# EAGLE schematic Sensormain_of_Tatebayashi (EAGLE 9.6.2)

## Sheet 1 of 5
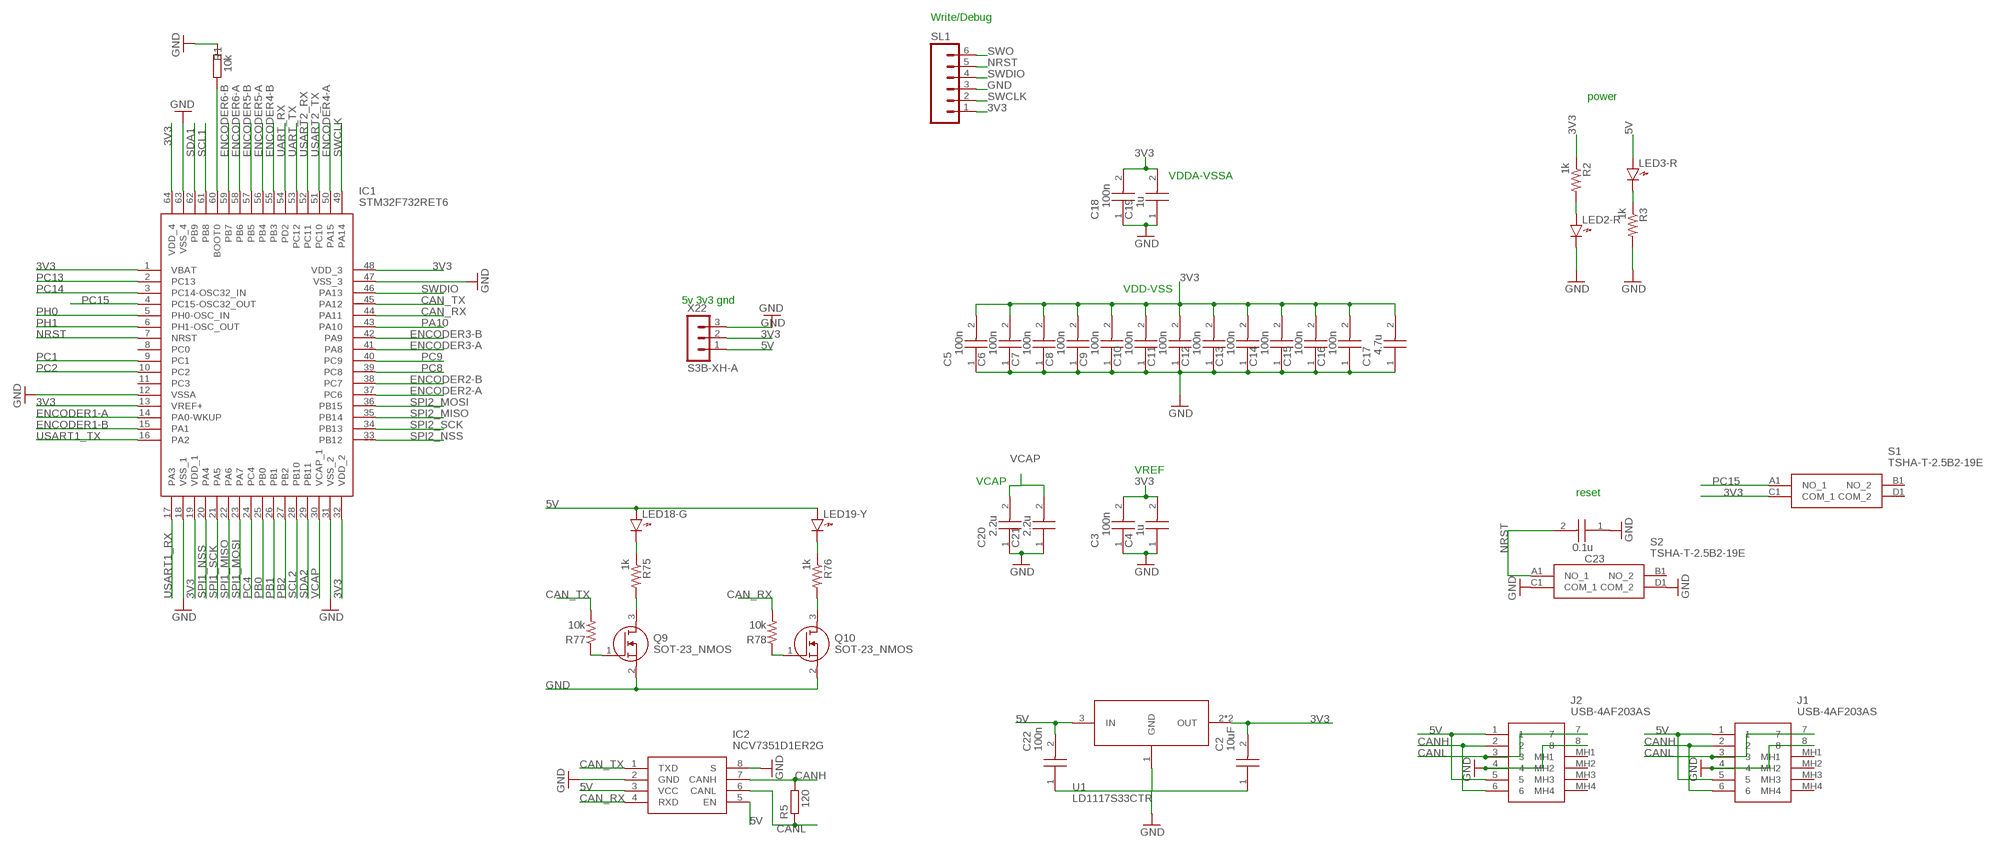
[diagram p0: schematic, sheet 1]

### Parts
C2  10uF  GRM188B31A106KE69D  [CAPC1608X90N]
C3  100n  AMK107BBJ476MA-RE  [CAPC1709X100N]
C4  1u  AMK107BBJ476MA-RE  [CAPC1709X100N]
C5  100n  AMK107BBJ476MA-RE  [CAPC1709X100N]
C6  100n  AMK107BBJ476MA-RE  [CAPC1709X100N]
C7  100n  AMK107BBJ476MA-RE  [CAPC1709X100N]
C8  100n  AMK107BBJ476MA-RE  [CAPC1709X100N]
C9  100n  AMK107BBJ476MA-RE  [CAPC1709X100N]
C10  100n  AMK107BBJ476MA-RE  [CAPC1709X100N]
C11  100n  AMK107BBJ476MA-RE  [CAPC1709X100N]
C12  100n  AMK107BBJ476MA-RE  [CAPC1709X100N]
C13  100n  AMK107BBJ476MA-RE  [CAPC1709X100N]
C14  100n  AMK107BBJ476MA-RE  [CAPC1709X100N]
C15  100n  AMK107BBJ476MA-RE  [CAPC1709X100N]
C16  100n  AMK107BBJ476MA-RE  [CAPC1709X100N]
C17  4.7u  AMK107BBJ476MA-RE  [CAPC1709X100N]
C18  100n  AMK107BBJ476MA-RE  [CAPC1709X100N]
C19  1u  AMK107BBJ476MA-RE  [CAPC1709X100N]
C20  2.2u  AMK107BBJ476MA-RE  [CAPC1709X100N]
C21  2.2u  AMK107BBJ476MA-RE  [CAPC1709X100N]
C22  100n  GRM188B31A106KE69D  [CAPC1608X90N]
C23  0.1u  AMK107BBJ476MA-RE  [CAPC1709X100N]
IC1  STM32F732RET6  [QFP50P1200X1200X160-64N]
IC2  NCV7351D1ER2G  [SOIC127P600X175-8N]
J1  USB-4AF203AS  [USB4AF203AS]
J2  USB-4AF203AS  [USB4AF203AS]
LED2-R  LED1608  [LED1608]
LED3-R  LED1608  [LED1608]
LED18-G  LED1608  [LED1608]
LED19-Y  LED1608  [LED1608]
Q9  SOT-23_NMOS  [SOT-23]
Q10  SOT-23_NMOS  [SOT-23]
R1  10k  R1608  [1608]
R2  1k  R-US_R0603  [R0603]
R3  1k  R-US_R0603  [R0603]
R5  120  R-EU_R0805  [R0805]
R75  1k  R-US_R0603  [R0603]
R76  1k  R-US_R0603  [R0603]
R77  10k  RESISTOR-US1608  [SMD1608]
R78  10k  RESISTOR-US1608  [SMD1608]
S1  TSHA-T-2.5B2-19E  [TSHAT25B219E]
S2  TSHA-T-2.5B2-19E  [TSHAT25B219E]
SL1  MA06  [06PA]
U1  LD1117S33CTR  [SOT223]
X22  S3B-XH-A  [S3B-XH-A]

### Nets
3V3: C2.2 C3.2 C4.2 C5.2 C6.2 C7.2 C8.2 C9.2 C10.2 C11.2 C12.2 C13.2 C14.2 C15.2 C16.2 C17.2 C18.2 C19.2 IC1.1(VBAT) IC1.13(VREF+) IC1.19(VDD_1) IC1.32(VDD_2) IC1.48(VDD_3) IC1.64(VDD_4) R2.1 S1.C1(COM_1) SL1.1 U1.2(OUT) U1.4(OUT) X22.2 ; also sheet 3,4,5
5V: C22.2 IC2.3(VCC) IC2.5(EN) J1.1 J1.5 J2.1 J2.5 LED3-R.A LED18-G.A LED19-Y.A U1.3(IN) X22.1 ; also sheet 2,3,4,5
CAN_RX: IC1.44(PA11) IC2.4(RXD) R78.2
CAN_TX: IC1.45(PA12) IC2.1(TXD) R77.2
CANH: IC2.7(CANH) J1.2 J1.6 J2.2 J2.6 R5.2
CANL: IC2.6(CANL) J1.3 J1.7 J2.3 J2.7 R5.1
ENCODER1-A: IC1.14(PA0-WKUP) ; also sheet 2
ENCODER1-B: IC1.15(PA1) ; also sheet 2
ENCODER2-A: IC1.37(PC6) ; also sheet 2
ENCODER2-B: IC1.38(PC7) ; also sheet 2
ENCODER3-A: IC1.41(PA8) ; also sheet 2
ENCODER3-B: IC1.42(PA9) ; also sheet 2
ENCODER4-A: IC1.50(PA15) ; also sheet 2
ENCODER4-B: IC1.55(PB3) ; also sheet 2
ENCODER5-A: IC1.56(PB4) ; also sheet 2
ENCODER5-B: IC1.57(PB5) ; also sheet 2
ENCODER6-A: IC1.58(PB6) ; also sheet 2
ENCODER6-B: IC1.59(PB7) ; also sheet 2
GND: C2.1 C3.1 C4.1 C5.1 C6.1 C7.1 C8.1 C9.1 C10.1 C11.1 C12.1 C13.1 C14.1 C15.1 C16.1 C17.1 C18.1 C19.1 C20.1 C21.1 C22.1 C23.1 IC1.12(VSSA) IC1.18(VSS_1) IC1.31(VSS_2) IC1.47(VSS_3) IC1.63(VSS_4) IC2.2(GND) IC2.8(S) J1.4 J1.8 J2.4 J2.8 LED2-R.K Q9.2(S) Q10.2(S) R1.2 R3.2 S2.C1(COM_1) S2.D1(COM_2) SL1.3 U1.1(GND) X22.3 ; also sheet 2,3,4,5
N$7: LED2-R.A R2.2
N$8: LED3-R.K R3.1
N$15: IC1.60(BOOT0) R1.1
N$71: Q9.1(G) R77.1
N$72: Q10.1(G) R78.1
N$73: LED18-G.K R75.1
N$75: LED19-Y.K R76.1
N$80: Q9.3(D) R75.2
N$85: Q10.3(D) R76.2
NRST: C23.2 IC1.7(NRST) S2.A1(NO_1) SL1.5
PA10: IC1.43(PA10) ; also sheet 4
PB0: IC1.25(PB0) ; also sheet 5
PB1: IC1.26(PB1) ; also sheet 5
PB2: IC1.27(PB2) ; also sheet 4
PC1: IC1.9(PC1) ; also sheet 5
PC2: IC1.10(PC2) ; also sheet 5
PC4: IC1.24(PC4) ; also sheet 5
PC8: IC1.39(PC8) ; also sheet 4
PC9: IC1.40(PC9) ; also sheet 4
PC13: IC1.2(PC13) ; also sheet 5
PC14: IC1.3(PC14-OSC32_IN) ; also sheet 5
PC15: IC1.4(PC15-OSC32_OUT) S1.A1(NO_1)
PH0: IC1.5(PH0-OSC_IN) ; also sheet 5
PH1: IC1.6(PH1-OSC_OUT) ; also sheet 5
SCL1: IC1.61(PB8) ; also sheet 4
SCL2: IC1.28(PB10) ; also sheet 4
SDA1: IC1.62(PB9) ; also sheet 4
SDA2: IC1.29(PB11) ; also sheet 4
SPI1_MISO: IC1.22(PA6) ; also sheet 3
SPI1_MOSI: IC1.23(PA7) ; also sheet 3
SPI1_NSS: IC1.20(PA4) ; also sheet 3
SPI1_SCK: IC1.21(PA5) ; also sheet 3
SPI2_MISO: IC1.35(PB14) ; also sheet 4
SPI2_MOSI: IC1.36(PB15) ; also sheet 4
SPI2_NSS: IC1.33(PB12) ; also sheet 4
SPI2_SCK: IC1.34(PB13) ; also sheet 4
SWCLK: IC1.49(PA14) SL1.2
SWDIO: IC1.46(PA13) SL1.4
SWO: SL1.6
UART_RX: IC1.54(PD2) ; also sheet 4
UART_TX: IC1.53(PC12) ; also sheet 4
USART1_RX: IC1.17(PA3) ; also sheet 4
USART1_TX: IC1.16(PA2) ; also sheet 4
USART2_RX: IC1.52(PC11) ; also sheet 4
USART2_TX: IC1.51(PC10) ; also sheet 4
VCAP: C20.2 C21.2 IC1.30(VCAP_1)
Unconnected: IC1.8(PC0) IC1.11(PC3) J1.MH1 J1.MH2 J1.MH3 J1.MH4 J2.MH1 J2.MH2 J2.MH3 J2.MH4 S1.B1(NO_2) S1.D1(COM_2) S2.B1(NO_2)

### Notes on the sheet
- Write/Debug
- power
- VDDA-VSSA
- VDD-VSS
- 5v 3v3 gnd
- VREF
- VCAP
- reset

## Sheet 2 of 5
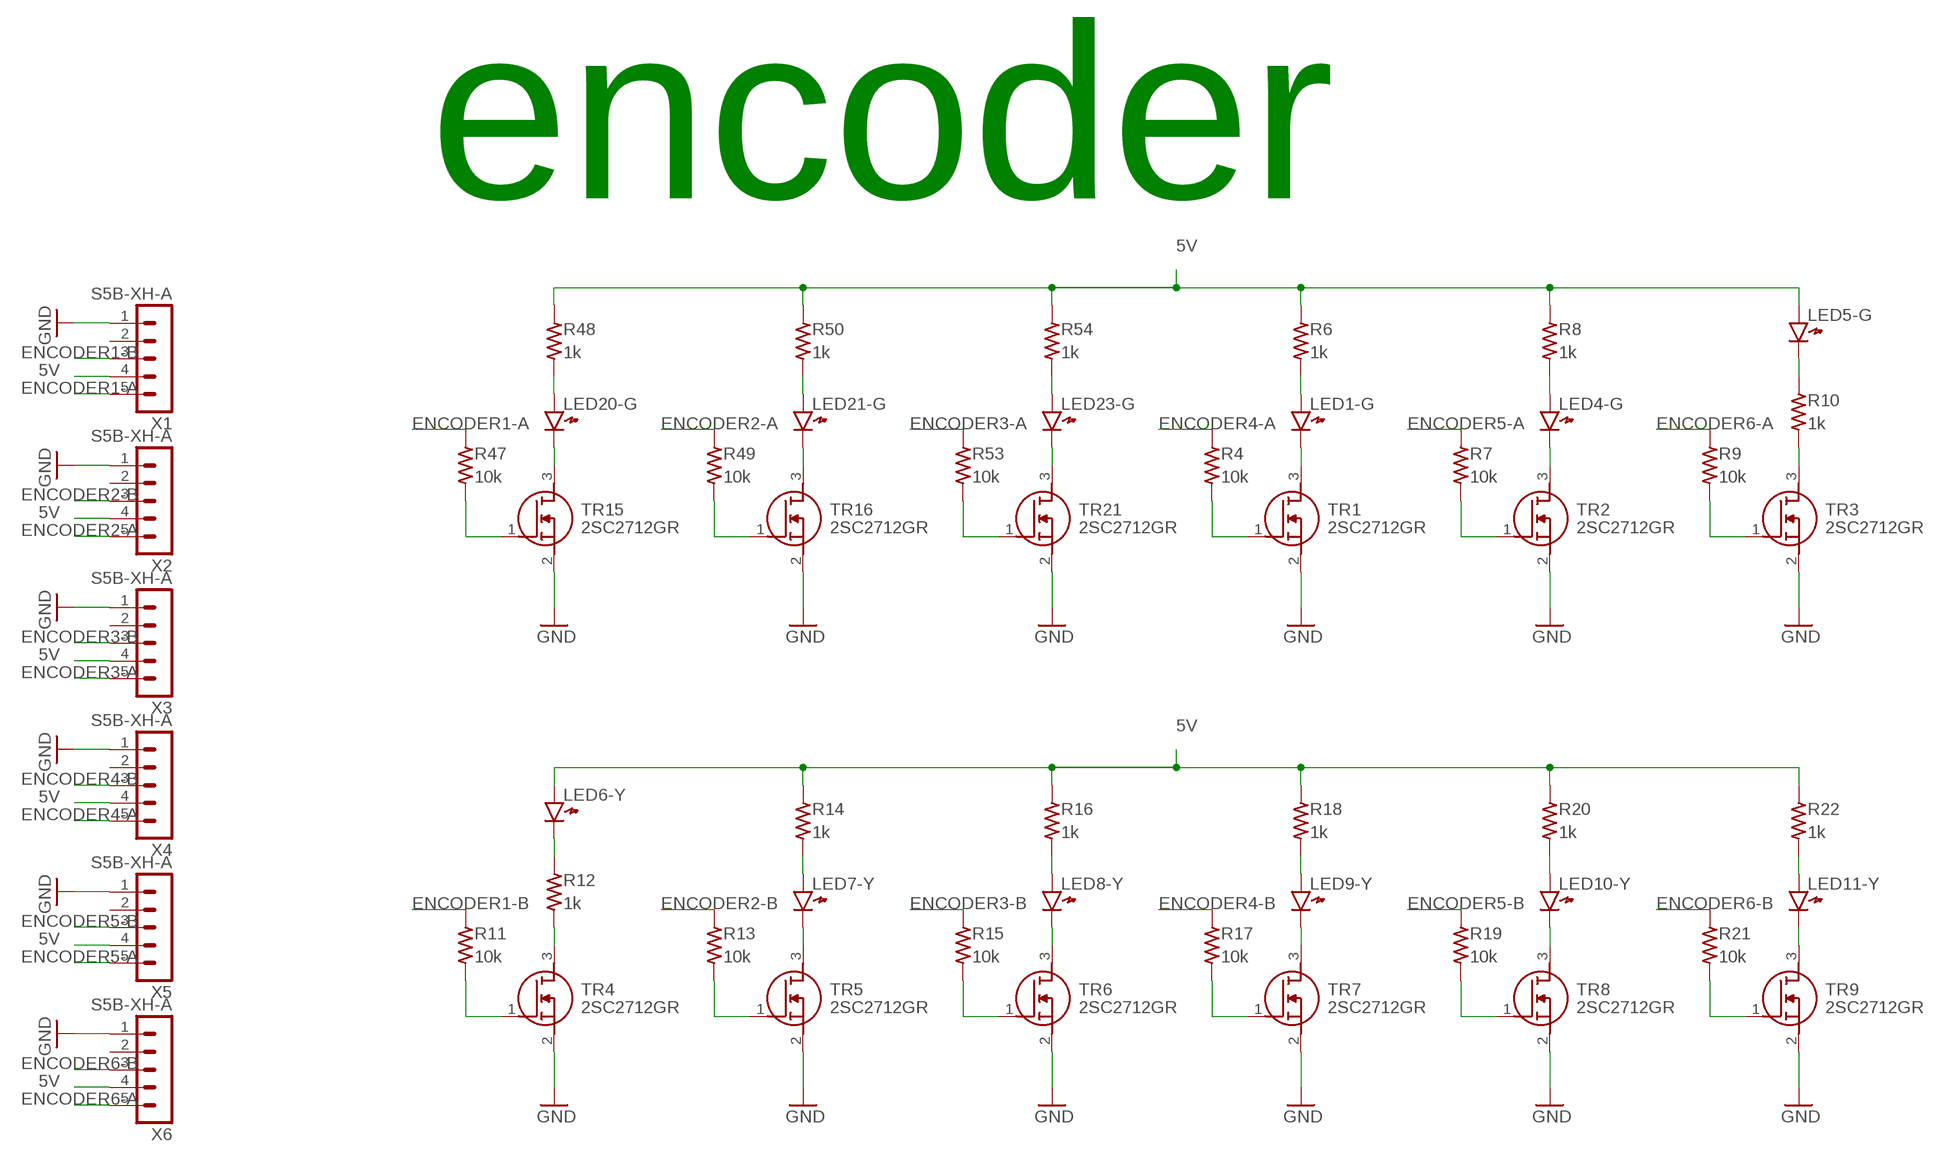
[diagram p1: schematic, sheet 2]

### Parts
LED1-G  LED1608  [LED1608]
LED4-G  LED1608  [LED1608]
LED5-G  LED1608  [LED1608]
LED6-Y  LED1608  [LED1608]
LED7-Y  LED1608  [LED1608]
LED8-Y  LED1608  [LED1608]
LED9-Y  LED1608  [LED1608]
LED10-Y  LED1608  [LED1608]
LED11-Y  LED1608  [LED1608]
LED20-G  LED1608  [LED1608]
LED21-G  LED1608  [LED1608]
LED23-G  LED1608  [LED1608]
R4  10k  RESISTOR-US1608  [SMD1608]
R6  1k  RESISTOR-US1608  [SMD1608]
R7  10k  RESISTOR-US1608  [SMD1608]
R8  1k  RESISTOR-US1608  [SMD1608]
R9  10k  RESISTOR-US1608  [SMD1608]
R10  1k  RESISTOR-US1608  [SMD1608]
R11  10k  RESISTOR-US1608  [SMD1608]
R12  1k  RESISTOR-US1608  [SMD1608]
R13  10k  RESISTOR-US1608  [SMD1608]
R14  1k  RESISTOR-US1608  [SMD1608]
R15  10k  RESISTOR-US1608  [SMD1608]
R16  1k  RESISTOR-US1608  [SMD1608]
R17  10k  RESISTOR-US1608  [SMD1608]
R18  1k  RESISTOR-US1608  [SMD1608]
R19  10k  RESISTOR-US1608  [SMD1608]
R20  1k  RESISTOR-US1608  [SMD1608]
R21  10k  RESISTOR-US1608  [SMD1608]
R22  1k  RESISTOR-US1608  [SMD1608]
R47  10k  RESISTOR-US1608  [SMD1608]
R48  1k  RESISTOR-US1608  [SMD1608]
R49  10k  RESISTOR-US1608  [SMD1608]
R50  1k  RESISTOR-US1608  [SMD1608]
R53  10k  RESISTOR-US1608  [SMD1608]
R54  1k  RESISTOR-US1608  [SMD1608]
TR1  2SC2712GR  SOT-23_NMOS  [SOT-23]
TR2  2SC2712GR  SOT-23_NMOS  [SOT-23]
TR3  2SC2712GR  SOT-23_NMOS  [SOT-23]
TR4  2SC2712GR  SOT-23_NMOS  [SOT-23]
TR5  2SC2712GR  SOT-23_NMOS  [SOT-23]
TR6  2SC2712GR  SOT-23_NMOS  [SOT-23]
TR7  2SC2712GR  SOT-23_NMOS  [SOT-23]
TR8  2SC2712GR  SOT-23_NMOS  [SOT-23]
TR9  2SC2712GR  SOT-23_NMOS  [SOT-23]
TR15  2SC2712GR  SOT-23_NMOS  [SOT-23]
TR16  2SC2712GR  SOT-23_NMOS  [SOT-23]
TR21  2SC2712GR  SOT-23_NMOS  [SOT-23]
X1  S5B-XH-A  [S5B-XH-A]
X2  S5B-XH-A  [S5B-XH-A]
X3  S5B-XH-A  [S5B-XH-A]
X4  S5B-XH-A  [S5B-XH-A]
X5  S5B-XH-A  [S5B-XH-A]
X6  S5B-XH-A  [S5B-XH-A]

### Nets
5V: LED5-G.A LED6-Y.A R6.1 R8.1 R14.1 R16.1 R18.1 R20.1 R22.1 R48.1 R50.1 R54.1 X1.4 X2.4 X3.4 X4.4 X5.4 X6.4 ; also sheet 1,3,4,5
ENCODER1-A: R47.1 X1.5 ; also sheet 1
ENCODER1-B: R11.1 X1.3 ; also sheet 1
ENCODER2-A: R49.1 X2.5 ; also sheet 1
ENCODER2-B: R13.1 X2.3 ; also sheet 1
ENCODER3-A: R53.1 X3.5 ; also sheet 1
ENCODER3-B: R15.1 X3.3 ; also sheet 1
ENCODER4-A: R4.1 X4.5 ; also sheet 1
ENCODER4-B: R17.1 X4.3 ; also sheet 1
ENCODER5-A: R7.1 X5.5 ; also sheet 1
ENCODER5-B: R19.1 X5.3 ; also sheet 1
ENCODER6-A: R9.1 X6.5 ; also sheet 1
ENCODER6-B: R21.1 X6.3 ; also sheet 1
GND: TR1.2(S) TR2.2(S) TR3.2(S) TR4.2(S) TR5.2(S) TR6.2(S) TR7.2(S) TR8.2(S) TR9.2(S) TR15.2(S) TR16.2(S) TR21.2(S) X1.1 X2.1 X3.1 X4.1 X5.1 X6.1 ; also sheet 1,3,4,5
N$1: LED20-G.K TR15.3(D)
N$2: LED20-G.A R48.2
N$3: R49.2 TR16.1(G)
N$4: R47.2 TR15.1(G)
N$5: LED21-G.K TR16.3(D)
N$6: LED21-G.A R50.2
N$9: R4.2 TR1.1(G)
N$10: R53.2 TR21.1(G)
N$11: LED1-G.K TR1.3(D)
N$12: LED1-G.A R6.2
N$13: LED23-G.K TR21.3(D)
N$14: R7.2 TR2.1(G)
N$16: LED4-G.K TR2.3(D)
N$17: LED4-G.A R8.2
N$18: R9.2 TR3.1(G)
N$19: LED5-G.K R10.1
N$20: R10.2 TR3.3(D)
N$21: R11.2 TR4.1(G)
N$22: LED6-Y.K R12.1
N$23: R12.2 TR4.3(D)
N$24: LED23-G.A R54.2
N$25: R13.2 TR5.1(G)
N$26: LED7-Y.K TR5.3(D)
N$27: LED7-Y.A R14.2
N$28: R15.2 TR6.1(G)
N$29: LED8-Y.K TR6.3(D)
N$30: LED8-Y.A R16.2
N$31: R17.2 TR7.1(G)
N$32: LED9-Y.K TR7.3(D)
N$33: LED9-Y.A R18.2
N$34: R19.2 TR8.1(G)
N$35: LED10-Y.K TR8.3(D)
N$36: LED10-Y.A R20.2
N$37: R21.2 TR9.1(G)
N$38: LED11-Y.A R22.2
N$39: LED11-Y.K TR9.3(D)
Unconnected: X1.2 X2.2 X3.2 X4.2 X5.2 X6.2

### Notes on the sheet
- encoder

## Sheet 3 of 5
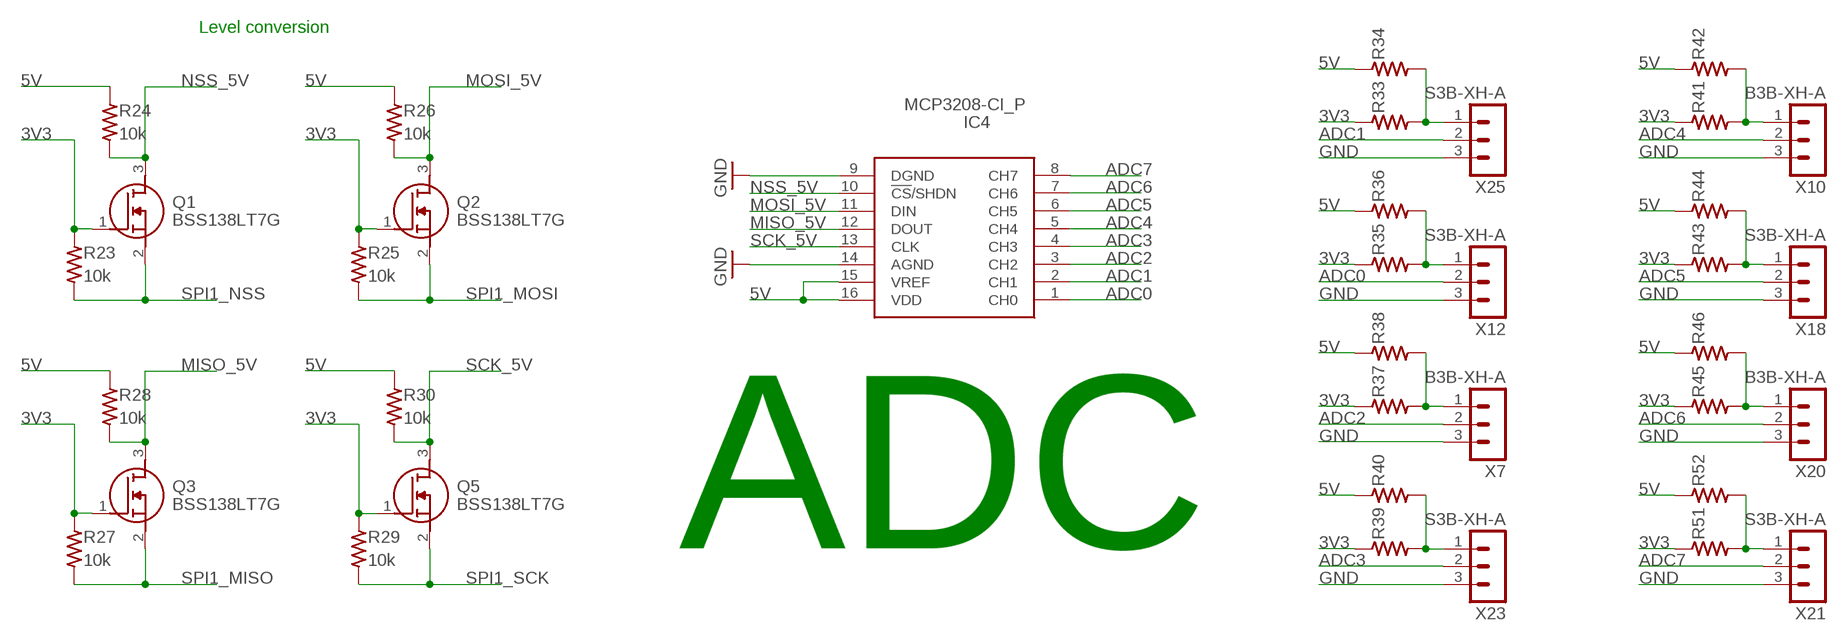
[diagram p2: schematic, sheet 3]

### Parts
IC4  MCP3208-CI_P  [DIP781W56P254L1918H533Q16N]
Q1  BSS138LT7G  [SOT96P237X111-3N]
Q2  BSS138LT7G  [SOT96P237X111-3N]
Q3  BSS138LT7G  [SOT96P237X111-3N]
Q5  BSS138LT7G  [SOT96P237X111-3N]
R23  10k  RESISTOR-US1608  [SMD1608]
R24  10k  RESISTOR-US1608  [SMD1608]
R25  10k  RESISTOR-US1608  [SMD1608]
R26  10k  RESISTOR-US1608  [SMD1608]
R27  10k  RESISTOR-US1608  [SMD1608]
R28  10k  RESISTOR-US1608  [SMD1608]
R29  10k  RESISTOR-US1608  [SMD1608]
R30  10k  RESISTOR-US1608  [SMD1608]
R33  RESISTOR-US1608  [SMD1608]
R34  RESISTOR-US1608  [SMD1608]
R35  RESISTOR-US1608  [SMD1608]
R36  RESISTOR-US1608  [SMD1608]
R37  RESISTOR-US1608  [SMD1608]
R38  RESISTOR-US1608  [SMD1608]
R39  RESISTOR-US1608  [SMD1608]
R40  RESISTOR-US1608  [SMD1608]
R41  RESISTOR-US1608  [SMD1608]
R42  RESISTOR-US1608  [SMD1608]
R43  RESISTOR-US1608  [SMD1608]
R44  RESISTOR-US1608  [SMD1608]
R45  RESISTOR-US1608  [SMD1608]
R46  RESISTOR-US1608  [SMD1608]
R51  RESISTOR-US1608  [SMD1608]
R52  RESISTOR-US1608  [SMD1608]
X7  B3B-XH-A  [B3B-XH-A]
X10  B3B-XH-A  [B3B-XH-A]
X12  S3B-XH-A  [S3B-XH-A]
X18  S3B-XH-A  [S3B-XH-A]
X20  B3B-XH-A  [B3B-XH-A]
X21  S3B-XH-A  [S3B-XH-A]
X23  S3B-XH-A  [S3B-XH-A]
X25  S3B-XH-A  [S3B-XH-A]

### Nets
3V3: Q1.1(G) Q2.1(G) Q3.1(G) Q5.1(G) R23.1 R25.1 R27.1 R29.1 R33.1 R35.1 R37.1 R39.1 R41.1 R43.1 R45.1 R51.1 ; also sheet 1,4,5
5V: IC4.15(VREF) IC4.16(VDD) R24.1 R26.1 R28.1 R30.1 R34.1 R36.1 R38.1 R40.1 R42.1 R44.1 R46.1 R52.1 ; also sheet 1,2,4,5
ADC0: IC4.1(CH0) X12.2
ADC1: IC4.2(CH1) X25.2
ADC2: IC4.3(CH2) X7.2
ADC3: IC4.4(CH3) X23.2
ADC4: IC4.5(CH4) X10.2
ADC5: IC4.6(CH5) X18.2
ADC6: IC4.7(CH6) X20.2
ADC7: IC4.8(CH7) X21.2
GND: IC4.9(DGND) IC4.14(AGND) X7.3 X10.3 X12.3 X18.3 X20.3 X21.3 X23.3 X25.3 ; also sheet 1,2,4,5
MISO_5V: IC4.12(DOUT) Q3.3(D) R28.2
MOSI_5V: IC4.11(DIN) Q2.3(D) R26.2
N$42: R33.2 R34.2 X25.1
N$43: R35.2 R36.2 X12.1
N$44: R37.2 R38.2 X7.1
N$45: R39.2 R40.2 X23.1
N$46: R41.2 R42.2 X10.1
N$47: R43.2 R44.2 X18.1
N$48: R45.2 R46.2 X20.1
N$49: R51.2 R52.2 X21.1
NSS_5V: IC4.10(!CS!/SHDN) Q1.3(D) R24.2
SCK_5V: IC4.13(CLK) Q5.3(D) R30.2
SPI1_MISO: Q3.2(S) R27.2 ; also sheet 1
SPI1_MOSI: Q2.2(S) R25.2 ; also sheet 1
SPI1_NSS: Q1.2(S) R23.2 ; also sheet 1
SPI1_SCK: Q5.2(S) R29.2 ; also sheet 1

### Notes on the sheet
- Level conversion
- ADC

## Sheet 4 of 5
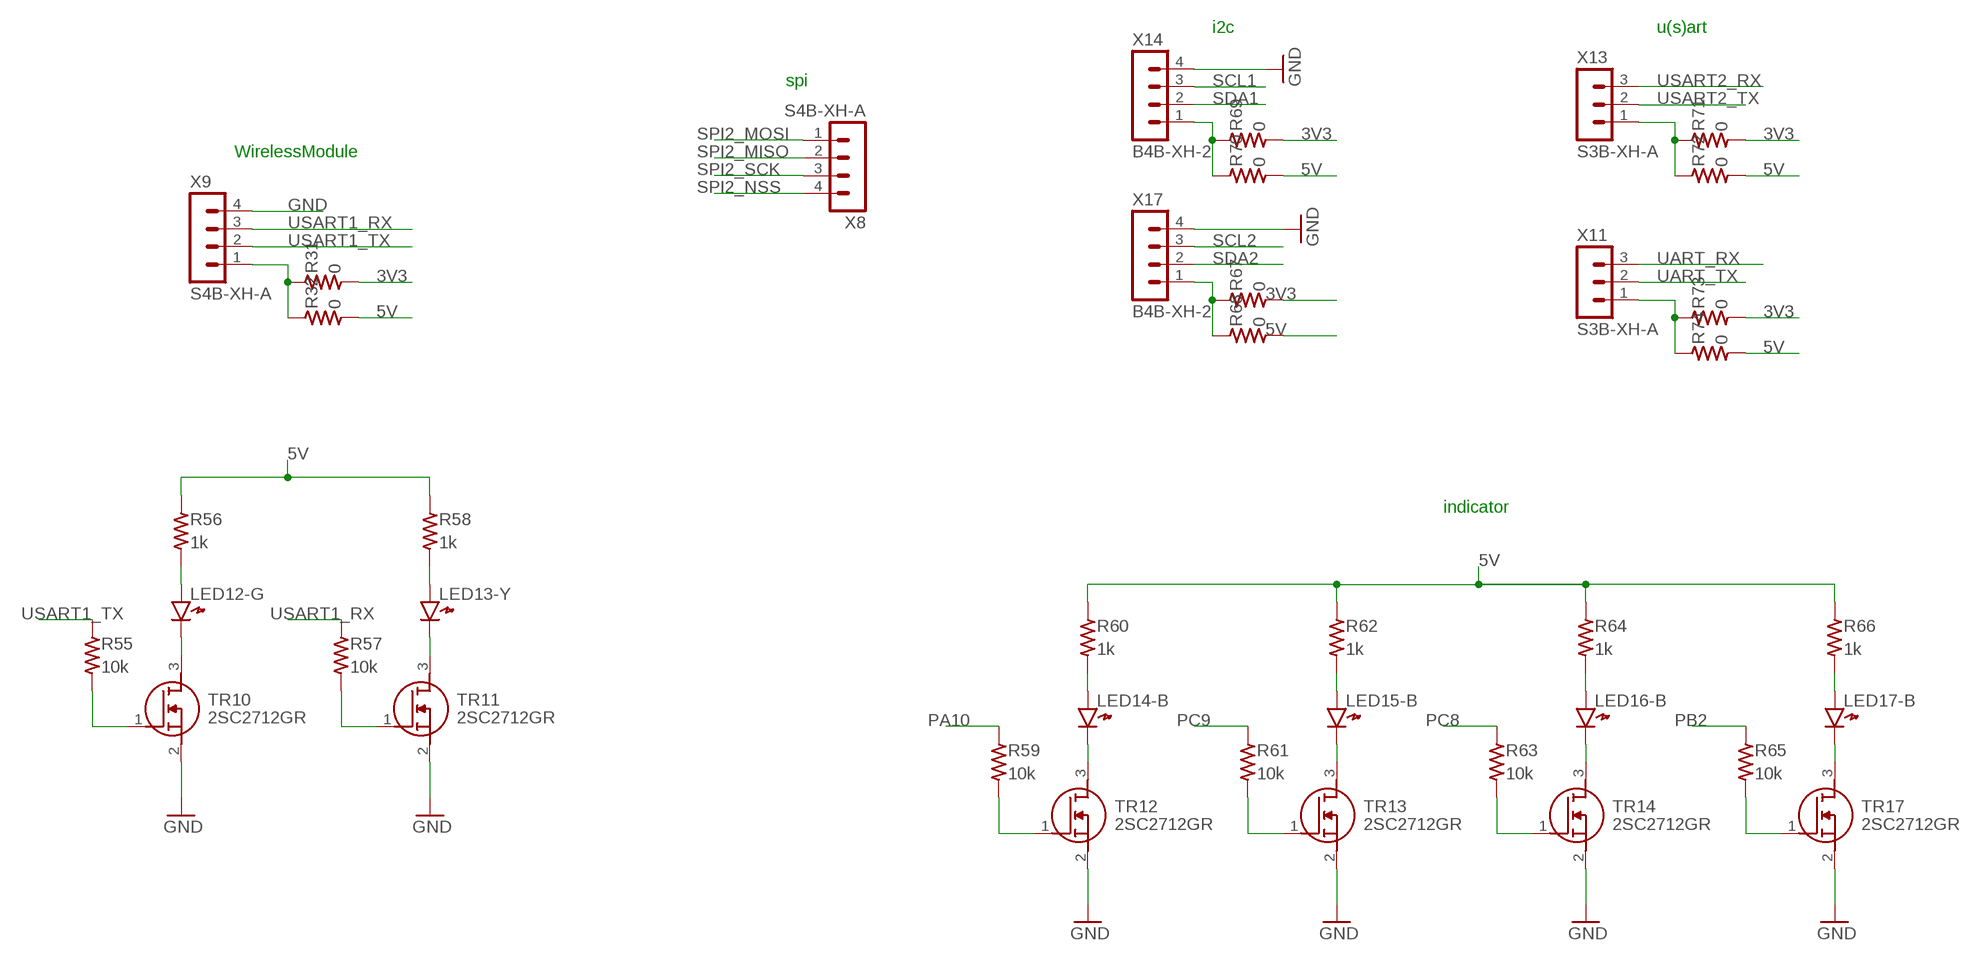
[diagram p3: schematic, sheet 4]

### Parts
LED12-G  LED1608  [LED1608]
LED13-Y  LED1608  [LED1608]
LED14-B  LED1608  [LED1608]
LED15-B  LED1608  [LED1608]
LED16-B  LED1608  [LED1608]
LED17-B  LED1608  [LED1608]
R31  0  RESISTOR-US1608  [SMD1608]
R32  0  RESISTOR-US1608  [SMD1608]
R55  10k  RESISTOR-US1608  [SMD1608]
R56  1k  RESISTOR-US1608  [SMD1608]
R57  10k  RESISTOR-US1608  [SMD1608]
R58  1k  RESISTOR-US1608  [SMD1608]
R59  10k  RESISTOR-US1608  [SMD1608]
R60  1k  RESISTOR-US1608  [SMD1608]
R61  10k  RESISTOR-US1608  [SMD1608]
R62  1k  RESISTOR-US1608  [SMD1608]
R63  10k  RESISTOR-US1608  [SMD1608]
R64  1k  RESISTOR-US1608  [SMD1608]
R65  10k  RESISTOR-US1608  [SMD1608]
R66  1k  RESISTOR-US1608  [SMD1608]
R67  0  RESISTOR-US1608  [SMD1608]
R68  0  RESISTOR-US1608  [SMD1608]
R69  0  RESISTOR-US1608  [SMD1608]
R70  0  RESISTOR-US1608  [SMD1608]
R71  0  RESISTOR-US1608  [SMD1608]
R72  0  RESISTOR-US1608  [SMD1608]
R73  0  RESISTOR-US1608  [SMD1608]
R74  0  RESISTOR-US1608  [SMD1608]
TR10  2SC2712GR  SOT-23_NMOS  [SOT-23]
TR11  2SC2712GR  SOT-23_NMOS  [SOT-23]
TR12  2SC2712GR  SOT-23_NMOS  [SOT-23]
TR13  2SC2712GR  SOT-23_NMOS  [SOT-23]
TR14  2SC2712GR  SOT-23_NMOS  [SOT-23]
TR17  2SC2712GR  SOT-23_NMOS  [SOT-23]
X8  S4B-XH-A  [S4B-XH-A]
X9  S4B-XH-A  [S4B-XH-A]
X11  S3B-XH-A  [S3B-XH-A]
X13  S3B-XH-A  [S3B-XH-A]
X14  B4B-XH-2  [B4B-XH-A]
X17  B4B-XH-2  [B4B-XH-A]

### Nets
3V3: R31.2 R67.2 R69.2 R71.2 R73.2 ; also sheet 1,3,5
5V: R32.2 R56.1 R58.1 R60.1 R62.1 R64.1 R66.1 R68.2 R70.2 R72.2 R74.2 ; also sheet 1,2,3,5
GND: TR10.2(S) TR11.2(S) TR12.2(S) TR13.2(S) TR14.2(S) TR17.2(S) X9.4 X14.4 X17.4 ; also sheet 1,2,3,5
N$40: R55.2 TR10.1(G)
N$41: R31.1 R32.1 X9.1
N$50: LED12-G.K TR10.3(D)
N$51: LED12-G.A R56.2
N$52: R57.2 TR11.1(G)
N$53: LED13-Y.K TR11.3(D)
N$54: LED13-Y.A R58.2
N$55: R59.2 TR12.1(G)
N$56: LED14-B.K TR12.3(D)
N$57: LED14-B.A R60.2
N$58: R61.2 TR13.1(G)
N$59: LED15-B.K TR13.3(D)
N$60: LED15-B.A R62.2
N$61: R63.2 TR14.1(G)
N$62: LED16-B.K TR14.3(D)
N$63: LED16-B.A R64.2
N$64: R65.2 TR17.1(G)
N$65: LED17-B.K TR17.3(D)
N$66: LED17-B.A R66.2
N$67: R69.1 R70.1 X14.1
N$68: R67.1 R68.1 X17.1
N$69: R71.1 R72.1 X13.1
N$70: R73.1 R74.1 X11.1
PA10: R59.1 ; also sheet 1
PB2: R65.1 ; also sheet 1
PC8: R63.1 ; also sheet 1
PC9: R61.1 ; also sheet 1
SCL1: X14.3 ; also sheet 1
SCL2: X17.3 ; also sheet 1
SDA1: X14.2 ; also sheet 1
SDA2: X17.2 ; also sheet 1
SPI2_MISO: X8.2 ; also sheet 1
SPI2_MOSI: X8.1 ; also sheet 1
SPI2_NSS: X8.4 ; also sheet 1
SPI2_SCK: X8.3 ; also sheet 1
UART_RX: X11.3 ; also sheet 1
UART_TX: X11.2 ; also sheet 1
USART1_RX: R57.1 X9.3 ; also sheet 1
USART1_TX: R55.1 X9.2 ; also sheet 1
USART2_RX: X13.3 ; also sheet 1
USART2_TX: X13.2 ; also sheet 1

### Notes on the sheet
- i2c | u(s)art
- spi
- WirelessModule
- indicator

## Sheet 5 of 5
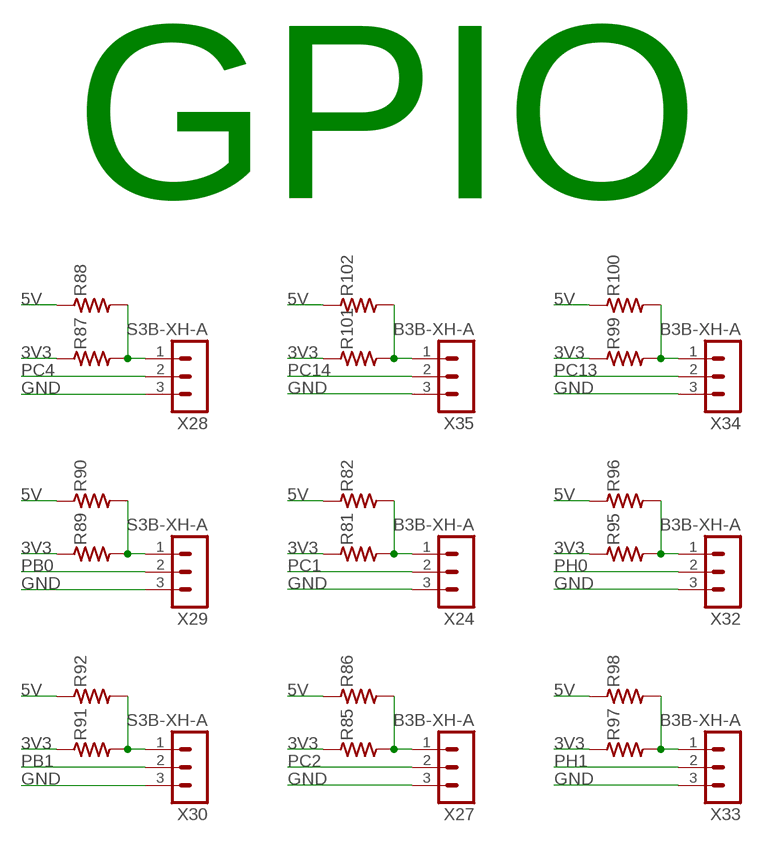
[diagram p4: schematic, sheet 5]

### Parts
R81  RESISTOR-US1608  [SMD1608]
R82  RESISTOR-US1608  [SMD1608]
R85  RESISTOR-US1608  [SMD1608]
R86  RESISTOR-US1608  [SMD1608]
R87  RESISTOR-US1608  [SMD1608]
R88  RESISTOR-US1608  [SMD1608]
R89  RESISTOR-US1608  [SMD1608]
R90  RESISTOR-US1608  [SMD1608]
R91  RESISTOR-US1608  [SMD1608]
R92  RESISTOR-US1608  [SMD1608]
R95  RESISTOR-US1608  [SMD1608]
R96  RESISTOR-US1608  [SMD1608]
R97  RESISTOR-US1608  [SMD1608]
R98  RESISTOR-US1608  [SMD1608]
R99  RESISTOR-US1608  [SMD1608]
R100  RESISTOR-US1608  [SMD1608]
R101  RESISTOR-US1608  [SMD1608]
R102  RESISTOR-US1608  [SMD1608]
X24  B3B-XH-A  [B3B-XH-A]
X27  B3B-XH-A  [B3B-XH-A]
X28  S3B-XH-A  [S3B-XH-A]
X29  S3B-XH-A  [S3B-XH-A]
X30  S3B-XH-A  [S3B-XH-A]
X32  B3B-XH-A  [B3B-XH-A]
X33  B3B-XH-A  [B3B-XH-A]
X34  B3B-XH-A  [B3B-XH-A]
X35  B3B-XH-A  [B3B-XH-A]

### Nets
3V3: R81.1 R85.1 R87.1 R89.1 R91.1 R95.1 R97.1 R99.1 R101.1 ; also sheet 1,3,4
5V: R82.1 R86.1 R88.1 R90.1 R92.1 R96.1 R98.1 R100.1 R102.1 ; also sheet 1,2,3,4
GND: X24.3 X27.3 X28.3 X29.3 X30.3 X32.3 X33.3 X34.3 X35.3 ; also sheet 1,2,3,4
N$74: R81.2 R82.2 X24.1
N$76: R85.2 R86.2 X27.1
N$77: R87.2 R88.2 X28.1
N$78: R89.2 R90.2 X29.1
N$79: R91.2 R92.2 X30.1
N$81: R95.2 R96.2 X32.1
N$82: R97.2 R98.2 X33.1
N$83: R99.2 R100.2 X34.1
N$84: R101.2 R102.2 X35.1
PB0: X29.2 ; also sheet 1
PB1: X30.2 ; also sheet 1
PC1: X24.2 ; also sheet 1
PC2: X27.2 ; also sheet 1
PC4: X28.2 ; also sheet 1
PC13: X34.2 ; also sheet 1
PC14: X35.2 ; also sheet 1
PH0: X32.2 ; also sheet 1
PH1: X33.2 ; also sheet 1

### Notes on the sheet
- GPIO

## Library data of the parts
C2 C22 = SamacSys_Parts:GRM188B31A106KE69D: Murata 1608 GRM 10000nF Ceramic Multilayer Capacitor, 10 V dc, +85C, B Dielectric, +/-10% Source: Datasheet <http://www.murata.com/~/media/webrenewal/support/library/catalog/products/capacitor/mlcc/c02e.pdf>; DESCRIPTION: Murata 1608 GRM 10000nF Ceramic Multilayer Capacitor, 10 V dc, +85C, B Dielectric, +/-10%; HEIGHT: 0.9mm; MANUFACTURER_NAME: Murata Electronics; MANUFACTURER_PART_NUMBER: GRM188B31A106KE69D; RS_PART_NUMBER: 8847157P; RS_PRICE-STOCK: http://uk.rs-online.com/web/p/products/8847157P
C3-C21 C23 = SamacSys_Parts:AMK107BBJ476MA-RE: 0603 (1608M) 47uF MLCC 4V dc +/-20% SMD Source: Datasheet <https://ds.yuden.co.jp/TYCOMPAS/ut/detail?pn=AMK107BBJ476MA-RE&u=M>; DESCRIPTION: 0603 (1608M) 47uF MLCC 4V dc +/-20% SMD; HEIGHT: 1mm; MANUFACTURER_NAME: TAIYO YUDEN; MANUFACTURER_PART_NUMBER: AMK107BBJ476MA-RE; MOUSER_PART_NUMBER: 963-AMK107BBJ476MARE; MOUSER_PRICE-STOCK: https://www.mouser.com/Search/Refine.aspx?Keyword=963-AMK107BBJ476MARE; RS_PART_NUMBER: 1843762P; RS_PRICE-STOCK: http://uk.rs-online.com/web/p/products/1843762P
IC1 = SamacSys_Parts:STM32F732RET6: STMICROELECTRONICS - STM32F732RET6 - MCU, ARM CORTEX-M7, 216MHZ, LQFP-64 Source: Datasheet <https://www.st.com/resource/en/datasheet/stm32f732re.pdf>; ARROW_PART_NUMBER: STM32F732RET6; ARROW_PRICE-STOCK: https://www.arrow.com/en/products/stm32f732ret6/stmicroelectronics?region=nac; DESCRIPTION: STMICROELECTRONICS - STM32F732RET6 - MCU, ARM CORTEX-M7, 216MHZ, LQFP-64; HEIGHT: 1.6mm; MANUFACTURER_NAME: STMicroelectronics; MANUFACTURER_PART_NUMBER: STM32F732RET6; MOUSER_PART_NUMBER: 511-STM32F732RET6; MOUSER_PRICE-STOCK: https://www.mouser.co.uk/ProductDetail/STMicroelectronics/STM32F732RET6?qs=ObEXV34I18OJOCW3Zu7wxw%3D%3D
IC2 = SamacSys_Parts:NCV7351D1ER2G: ON Semiconductor NCV7351D1ER2G, CAN Transceiver 1Mbit/s 1-channel ISO 11898-2, 8-Pin SOIC Source: Datasheet <http://www.onsemi.com/pub/Collateral/NCV7351-D.PDF>; ARROW_PART_NUMBER: NCV7351D1ER2G; ARROW_PRICE-STOCK: https://www.arrow.com/en/products/ncv7351d1er2g/on-semiconductor; DESCRIPTION: ON Semiconductor NCV7351D1ER2G, CAN Transceiver 1Mbit/s 1-channel ISO 11898-2, 8-Pin SOIC; HEIGHT: 1.75mm; MANUFACTURER_NAME: ON Semiconductor; MANUFACTURER_PART_NUMBER: NCV7351D1ER2G; MOUSER_PART_NUMBER: 863-NCV7351D1ER2G; MOUSER_PRICE-STOCK: https://www.mouser.co.uk/ProductDetail/ON-Semiconductor/NCV7351D1ER2G?qs=l5F7KFZg3O5tNFBk2wxDRg%3D%3D
IC4 = SamacSys_Parts:MCP3208-CI_P: A/D Converters Source: Datasheet <https://eu.mouser.com/datasheet/2/268/21298e-1101808.pdf>; ARROW_PART_NUMBER: MCP3208-CI/P; ARROW_PRICE-STOCK: https://www.arrow.com/en/products/mcp3208-cip/microchip-technology?region=europe; DESCRIPTION: A/D Converters; HEIGHT: 5.334mm; MANUFACTURER_NAME: Microchip; MANUFACTURER_PART_NUMBER: MCP3208-CI/P; MOUSER_PART_NUMBER: 579-MCP3208CIP; MOUSER_PRICE-STOCK: https://www.mouser.co.uk/ProductDetail/Microchip-Technology/MCP3208-CI-P?qs=9y3LFqDLL8IuAGJEebQX9g%3D%3D
J1 J2 = SamacSys_Parts:USB-4AF203AS: USB Connector, A type Female, Dual Port 4P x 2 Stacked, Right Angle type. Source: Datasheet <http://akizukidenshi.com/download/ds/useconn/USB-4AF203AS-CT.PDF>; DESCRIPTION: USB Connector, A type Female, Dual Port 4P x 2 Stacked, Right Angle type.; HEIGHT: 15.5mm; MANUFACTURER_NAME: Useconn Electronics; MANUFACTURER_PART_NUMBER: USB-4AF203AS
LED1-G LED2-R LED3-R LED4-G LED5-G LED6-Y LED7-Y LED8-Y LED9-Y LED10-Y LED11-Y LED12-G LED13-Y LED14-B LED15-B LED16-B LED17-B LED18-G LED19-Y LED20-G LED21-G LED23-G = generic:LED: Generic LEDs
Q1-Q3 Q5 = SamacSys_Parts:BSS138LT7G: MOSFET Single N-Channel Logic Level Power MOSFET 50V, 200mA, 3.5 Source: Datasheet; ARROW_PART_NUMBER: BSS138LT7G; ARROW_PRICE-STOCK: https://www.arrow.com/en/products/bss138lt7g/on-semiconductor; DESCRIPTION: MOSFET Single N-Channel Logic Level Power MOSFET 50V, 200mA, 3.5; HEIGHT: 1.11mm; MANUFACTURER_NAME: onsemi; MANUFACTURER_PART_NUMBER: BSS138LT7G; MOUSER_PART_NUMBER: 863-BSS138LT7G; MOUSER_PRICE-STOCK: https://www.mouser.co.uk/ProductDetail/onsemi/BSS138LT7G?qs=l7cgNqFNU1gVGpXKtqpwiw%3D%3D
Q9 Q10 TR1-TR17 TR21 = maya_smd:SOT-23_NMOS
R1 = 1608:R1608
R2 R3 R75 R76 = audio amplifier example:R-US_: RESISTOR, American symbol
R4 R6-R74 R77 R78 R81 R82 R85-R92 R95-R102 = generic:RESISTOR-US: Generic Registor
R5 = rcl:R-EU_: RESISTOR, European symbol; SPICEPREFIX: R
S1 S2 = SamacSys_Parts:TSHA-T-2.5B2-19E: Switch Source: Datasheet <http://akizukidenshi.com/download/ds/topup/TSHA-T-2.5B2-19E.pdf>; DESCRIPTION: Switch; HEIGHT: 2.5mm; MANUFACTURER_NAME: Akizuki Denshi Tsusho; MANUFACTURER_PART_NUMBER: TSHA-T-2.5B2-19E
SL1 = con-amp-quick:MA06: AMP QUICK CONNECTOR; OC_FARNELL: unknown; OC_NEWARK: unknown
U1 = LD1117S33CTR:LD1117S33CTR: http://octopart.com/ld1117s33tr-stmicroelectronics-526708; AVAILABILITY: Unavailable; DESCRIPTION: LD1117 Series 1300 mA 3.3 V Fixed Output Positive Voltage LDO Regulator- SOT-223; MF: STMicroelectronics; MP: LD1117S33CTR; PACKAGE: SOT-223 STMicroelectronics; PRICE: None
X1-X6 = con-JST XH:S5B-XH: JST XH series header 2.50mm pitch disconnectable crimp style connectors, horizontal (side entry type), 5 pins
X7 X10 X20 X24 X27 X32-X35 = con-JST XH:B3B-XH: JST XH series header 2.50mm pitch disconnectable crimp style connectors, vertical (side entry type), 3 pins
X8 X9 = con-JST XH:S4B-XH: JST XH series header 2.50mm pitch disconnectable crimp style connectors, horizontal (side entry type), 4 pins
X11-X13 X18 X21 X23 X25 X28-X30 = con-JST XH:S3B-XH: JST XH series header 2.50mm pitch disconnectable crimp style connectors, horizontal (side entry type), 3 pins
X14 X17 = con-JST_XH:B4B-XH: JST XH series header 2.50mm pitch disconnectable crimp style connectors, vertical (side entry type), 4 pins
X22 = con-JST_XH:S3B-XH: JST XH series header 2.50mm pitch disconnectable crimp style connectors, horizontal (side entry type), 3 pins